# Altium schematic sheet Sheet3.SchDoc
size A
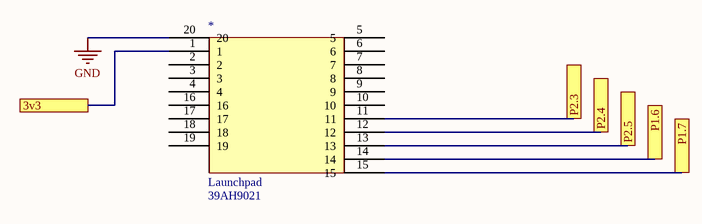
[diagram p0: Sheet3.SchDoc]

## Parts
*  Launchpad  Supplier Part Number 1: 39AH9021  [MSP430 Launchpad]

## Ports
3v3, P1.6, P1.7, P2.3, P2.4, P2.5

## Nets
GND: *.20
3v3: *.1 ; port 3v3
P1.6: *.14 ; port P1.6
P1.7: *.15 ; port P1.7
P2.3: *.11 ; port P2.3
P2.4: *.12 ; port P2.4
P2.5: *.13 ; port P2.5

Not connected (* = marked no-connect by the designer): * 2 3 4 5 6 7 8 9 10 16 17 18 19

## Library data of the parts
* = Launchpad: MSP430G2XX, LAUNCHPAD, FLASH EMULATION, DEV KIT; Manufacturer: Texas Instruments; Manufacturer Part Number: MSP-EXP430G2; Core Architecture: MSP430; Evaluation Kit: Yes; Interface: USB; Data Bus Width: 16b; Number of Bits: 16; Supplier 1: Newark; RoHS: Yes; Category: Embedded Processors and Controllers; Mount: Socket; Number of Pins: 0.7; Weight: 0.22lb; Packaging: Bulk; Package Quantity: 1; Length: 3.94inch; Height: 1.97inch; Width: 3.94inch; Radiation Hardening: No; REACH SVHC: No SVHC; ComponentLink1URL: https://datasheet.ciiva.com/2398/slay017-2398228.pdf?src-supplier=Digi-Key; ComponentLink1Description: https://datasheet.ciiva.com/2398/slay017-2398228.pdf?src-supplier=Digi-Key; ComponentLink2URL: https://datasheet.ciiva.com/27059/2207275-27059764.pdf?src-supplier=Jameco; ComponentLink2Description: https://datasheet.ciiva.com/27059/2207275-27059764.pdf?src-supplier=Jameco; ComponentLink3URL: https://datasheet.ciiva.com/20167/73-4724-20167738.pdf?src-supplier=Rapid+Electronics; ComponentLink3Description: https://datasheet.ciiva.com/20167/73-4724-20167738.pdf?src-supplier=Rapid+Electronics; ComponentLink4URL: https://datasheet.ciiva.com/26344/414784-da-01-en-launchpad-devel-tool-msp-exp430g2-tid-26344585.pdf?src-supplier=Conrad; ComponentLink4Description: https://datasheet.ciiva.com/26344/414784-da-01-en-launchpad-devel-tool-msp-exp430g2-tid-26344585.pdf?src-supplier=Conrad